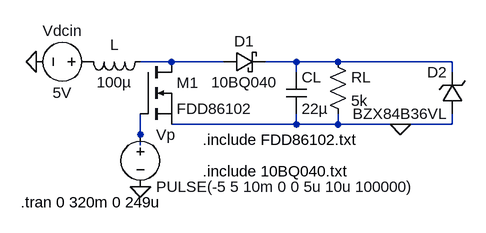
[diagram p0: schematic 3_4_f.asc]
3_4_f.asc, the LTspice schematic file:
Version 4
SHEET 1 880 680
WIRE 176 96 128 96
WIRE 256 96 176 96
WIRE 368 96 320 96
WIRE 432 96 368 96
WIRE 608 96 432 96
WIRE 368 112 368 96
WIRE 608 112 608 96
WIRE 368 192 368 176
WIRE 368 192 176 192
WIRE 432 192 432 176
WIRE 432 192 368 192
WIRE 528 192 432 192
WIRE 608 192 608 176
WIRE 608 192 528 192
WIRE 128 208 128 176
WIRE 128 224 128 208
FLAG -32 96 0
FLAG 528 192 0
FLAG 128 288 0
SYMBOL nmos 128 96 R0
SYMATTR InstName M1
SYMATTR Value FDD86102
SYMATTR Prefix X
SYMBOL schottky 256 112 R270
WINDOW 0 32 32 VTop 2
WINDOW 3 0 32 VBottom 2
SYMATTR InstName D1
SYMATTR Value 10BQ040
SYMBOL cap 352 112 R0
SYMATTR InstName CL
SYMATTR Value 22µ
SYMBOL res 416 80 R0
SYMATTR InstName RL
SYMATTR Value 5k
SYMBOL ind 144 80 R90
WINDOW 0 5 56 VBottom 2
WINDOW 3 32 56 VTop 2
SYMATTR InstName L
SYMATTR Value 100µ
SYMBOL voltage 64 96 R90
WINDOW 0 -32 56 VBottom 2
WINDOW 3 32 56 VTop 2
SYMATTR InstName Vdcin
SYMATTR Value 5V
SYMBOL voltage 128 192 R0
WINDOW 123 0 0 Left 0
WINDOW 39 0 0 Left 0
SYMATTR InstName Vp
SYMATTR Value PULSE(-5 5 10m 0 0 5u 10u 100000)
SYMBOL zener 624 176 R180
WINDOW 0 24 64 Left 2
WINDOW 3 24 0 Left 2
SYMATTR InstName D2
SYMATTR Value BZX84B36VL
TEXT 224 216 Left 2 !.include FDD86102.txt
TEXT 224 264 Left 2 !.include 10BQ040.txt
TEXT -56 312 Left 2 !.tran 0 320m 0 249u

The netlist it stands for:
* 3_4_f.asc
XM1 N001 N003 0 FDD86102  ; pins D G S
D1 N001 N002 10BQ040
CL N002 0 22µ
RL N002 0 5k
L N001 P001 100µ
Vdcin P001 0 5V
Vp N003 0 PULSE(-5 5 10m 0 0 5u 10u 100000)
D2 0 N002 BZX84B36VL
.model D D
.lib standard.dio
.include FDD86102.txt
.include 10BQ040.txt
.tran 0 320m 0 249u
.backanno
.end